# EAGLE design ESP32-S3 Parallel TFT with Touch 3.5'' ili9488 v2.0 (EAGLE 6.1)
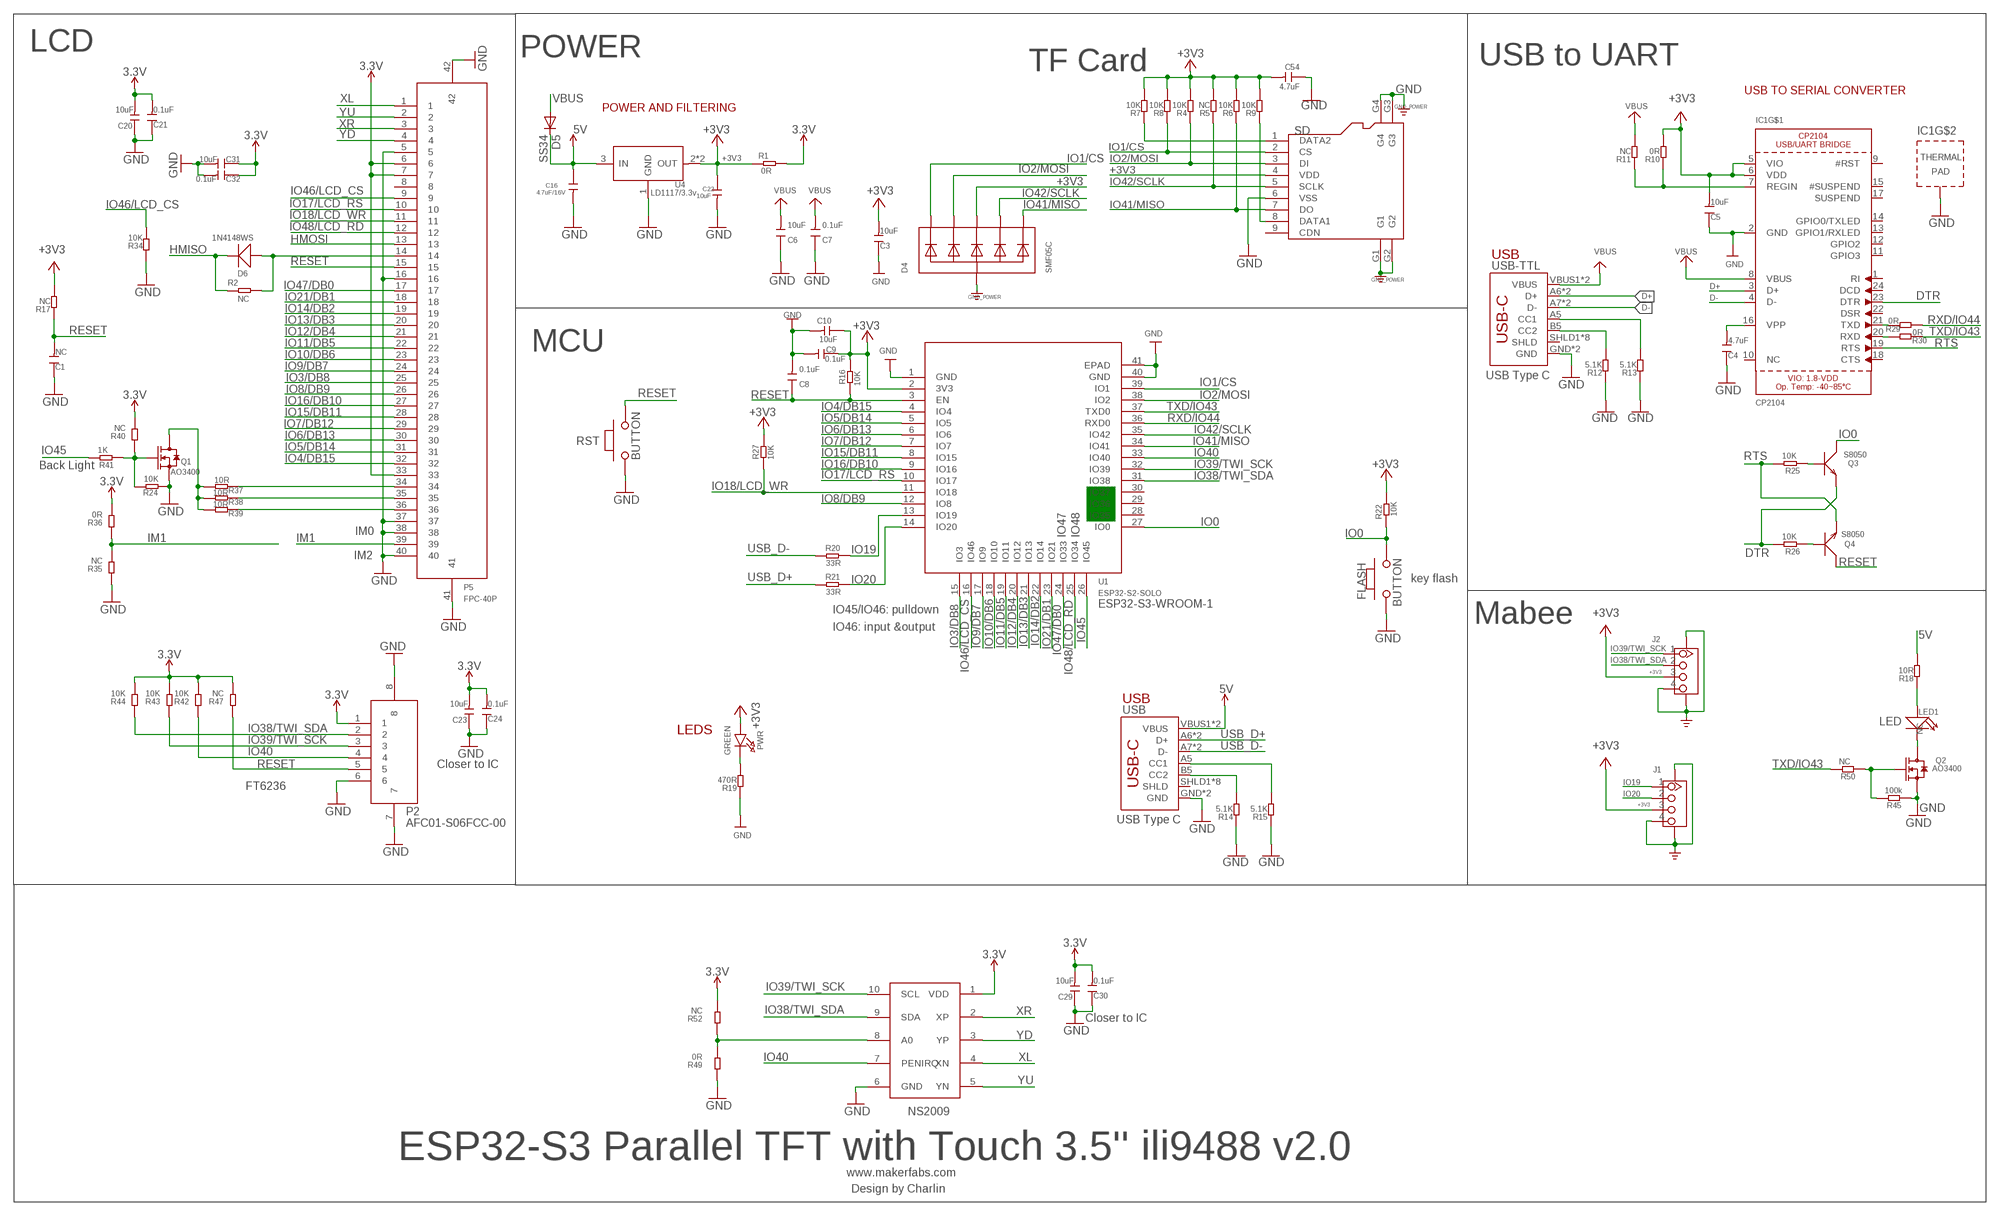
[diagram p0: schematic, sheet 1]

## Parts
C1  NC  DISCRETE_C-0603  [DISCRETE_C0603]
C3  10uF  DISCRETE_C-0603  [DISCRETE_C0603]
C4  4.7uF  DISCRETE_C-0603  [DISCRETE_C0603]
C5  10uF  DISCRETE_C-0603  [DISCRETE_C0603]
C6  10uF  DISCRETE_C-0603  [DISCRETE_C0603]
C7  0.1uF  DISCRETE_C-0603  [DISCRETE_C0603]
C8  0.1uF  DISCRETE_C-0603  [DISCRETE_C0603]
C9  0.1uF  DISCRETE_C-0603  [DISCRETE_C0603]
C10  10uF  DISCRETE_C-0603  [DISCRETE_C0603]
C16  4.7uF/16V  C-0603  [0603]
C20  10uF  DISCRETE_C-0603  [DISCRETE_C0603]
C21  0.1uF  DISCRETE_C-0603  [DISCRETE_C0603]
C22  10uF  C-0603  [0603]
C23  10uF  DISCRETE_C-0603  [DISCRETE_C0603]
C24  0.1uF  DISCRETE_C-0603  [DISCRETE_C0603]
C29  10uF  DISCRETE_C-0603  [DISCRETE_C0603]
C30  0.1uF  DISCRETE_C-0603  [DISCRETE_C0603]
C31  10uF  DISCRETE_C-0603  [DISCRETE_C0603]
C32  0.1uF  DISCRETE_C-0603  [DISCRETE_C0603]
C54  4.7uF  DISCRETE_C-0603  [DISCRETE_C0603]
D4  SMF05C  TVSARRAY_5LANE  [SOT363]
D5  SS34  DIODE-DO-214AC  [DO-214AC]
D6  1N4148WS  D'0805'  [SOD323]
FLASH  BUTTON  PB157  [157SW]
IC1  CP2104  [QFN24_4MM_SMSC]
J1  GROVE-CONNECTOR-SMD'90D'  [HW4-SMD-2.0-90D]
J2  GROVE-CONNECTOR-SMD'90D'  [HW4-SMD-2.0-90D]
LED1  NC  DISCRETE_LED3528  [DISCRETE_LED-3528]
P2  AFC01-S06FCC-00  [SMD8-50P-740L535W]
P5  FPC-40P  [SMD42-50P-2560L490W]
PWR  GREEN  LED0805_NOOUTLINE  [CHIPLED_0805_NOOUTLINE]
Q1  AO3400  MOSFET-N'SOT23'  [SOT23@1]
Q2  AO3400  MOSFET-N'SOT23'  [SOT23@1]
Q3  S8050  TRANSISTOR-NPN-SOT23  [SOT23]
Q4  S8050  TRANSISTOR-NPN-SOT23  [SOT23]
R1  0R  R-0603  [R0603]
R2  NC  R-0603  [R0603]
R4  10K  DISCRETE_R-0603  [DISCRETE_R0603]
R5  NC  DISCRETE_R-0603  [DISCRETE_R0603]
R6  10K  DISCRETE_R-0603  [DISCRETE_R0603]
R7  10K  DISCRETE_R-0603  [DISCRETE_R0603]
R8  10K  DISCRETE_R-0603  [DISCRETE_R0603]
R9  10K  DISCRETE_R-0603  [DISCRETE_R0603]
R10  0R  DISCRETE_R-0603  [DISCRETE_R0603]
R11  NC  DISCRETE_R-0603  [DISCRETE_R0603]
R12  5.1K  DISCRETE_R-0603  [DISCRETE_R0603]
R13  5.1K  DISCRETE_R-0603  [DISCRETE_R0603]
R14  5.1K  DISCRETE_R-0603  [DISCRETE_R0603]
R15  5.1K  DISCRETE_R-0603  [DISCRETE_R0603]
R16  10K  R-0603  [R0603]
R17  NC  DISCRETE_R-0603  [DISCRETE_R0603]
R18  10R  DISCRETE_R-0603  [DISCRETE_R0603]
R19  470R  DISCRETE_R-0603  [DISCRETE_R0603]
R20  33R  R-0603  [R0603]
R21  33R  R-0603  [R0603]
R22  10K  R-0603  [R0603]
R24  10K  DISCRETE_R-0603  [DISCRETE_R0603]
R25  10K  R-0603  [R0603]
R26  10K  R-0603  [R0603]
R27  10K  R-0603  [R0603]
R29  0R  R-0603  [R0603]
R30  0R  R-0603  [R0603]
R34  10K  DISCRETE_R-0603  [DISCRETE_R0603]
R35  NC  DISCRETE_R-0603  [DISCRETE_R0603]
R36  0R  DISCRETE_R-0603  [DISCRETE_R0603]
R37  10R  DISCRETE_R-0603  [DISCRETE_R0603]
R38  10R  DISCRETE_R-0603  [DISCRETE_R0603]
R39  10R  DISCRETE_R-0603  [DISCRETE_R0603]
R40  NC  DISCRETE_R-0603  [DISCRETE_R0603]
R41  1K  DISCRETE_R-0603  [DISCRETE_R0603]
R42  10K  DISCRETE_R-0603  [DISCRETE_R0603]
R43  10K  DISCRETE_R-0603  [DISCRETE_R0603]
R44  10K  DISCRETE_R-0603  [DISCRETE_R0603]
R45  100k  R-0603  [R0603]
R47  NC  DISCRETE_R-0603  [DISCRETE_R0603]
R49  0R  DISCRETE_R-0603  [DISCRETE_R0603]
R50  NC  R-0603  [R0603]
R52  NC  DISCRETE_R-0603  [DISCRETE_R0603]
RST  BUTTON  PB157  [157SW]
SD  HOLDER-MICROSD-9P  [9P-SMD-W/-RING]
U1  ESP32­S2­SOLO  [ESP32-­S2-­SOLO]
U4  LD1117/3.3v  LD1117'SOT89'  [SOT89]
U8  NS2009  [MSOP10]
USB  USB_C5  [USB-C-16P-5]
USB-TTL  USB_C5  [USB-C-16P-5]

## Nets
3.3V: C20.2 C21.2 C23.2 C24.2 C29.2 C30.2 C31.1 C32.1 P2.1 P5.6 P5.7 P5.33 R1.2 R36.2 R40.2 R42.2 R43.2 R44.2 R47.2 R52.2 U8.1(VDD)
5V: C16.1 D5.C R18.2 U4.3(IN) USB.VBUS1(VBUS) USB.VBUS2(VBUS)
+3V3: C3.2 C5.2 C9.1 C10.1 C22.1 C54.2 D4.4(C3) IC1.5(VIO) IC1.6(VDD) J1.3 J2.3 PWR.A R1.1 R4.2 R5.2 R6.2 R7.2 R8.2 R9.2 R10.2 R16.2 R17.2 R22.2 R27.2 SD.4(VDD) U1.2(3V3) U4.2(OUT) U4.4(OUT)
D+: IC1.3(D+) USB-TTL.A6(D+) USB-TTL.B6(D+)
D-: IC1.4(D-) USB-TTL.A7(D-) USB-TTL.B7(D-)
DTR: IC1.23(DTR) Q3.2(E) R26.2
GND: C1.1 C3.1 C4.1 C5.1 C6.1 C7.1 C8.2 C9.2 C10.2 C16.2 C20.1 C21.1 C22.2 C23.1 C24.1 C29.1 C30.1 C31.2 C32.2 C54.1 D4.2(A) FLASH.1 IC1.2(GND) IC1.THERM(TP) J1.4 J1.SS1 J1.SS2 J2.4 J2.SS1 J2.SS2 P2.6 P2.7 P2.8 P5.5 P5.16 P5.37 P5.38 P5.40 P5.41 P5.42 Q1.2(S) Q2.2(S) R12.1 R13.1 R14.1 R15.1 R19.1 R24.1 R34.1 R35.1 R45.1 R49.1 RST.1 SD.6(VSS) SD.G1 SD.G2 SD.G3 SD.G4 U1.1(GND) U1.40(GND) U1.41(EPAD) U4.1(GND) U8.6(GND) USB-TTL.GND USB-TTL.GND2(GND) USB.GND USB.GND2(GND) ; supply symbol labelled GND_POWER
HMISO: D6.- R2.1
HMOSI: P5.13
IM1: P5.39 R35.2 R36.1
IO0: FLASH.2 Q3.3(C) R22.1 U1.27(IO0)
IO1/CS: D4.1(C1) R8.1 SD.2(CS) U1.39(IO1)
IO2/MOSI: D4.3(C2) R4.1 SD.3(DI) U1.38(IO2)
IO3/DB8: P5.25 U1.15(IO3)
IO4/DB15: P5.32 U1.4(IO4)
IO5/DB14: P5.31 U1.5(IO5)
IO6/DB13: P5.30 U1.6(IO6)
IO7/DB12: P5.29 U1.7(IO7)
IO8/DB9: P5.26 U1.12(IO8)
IO9/DB7: P5.24 U1.17(IO9)
IO10/DB6: P5.23 U1.18(IO10)
IO11/DB5: P5.22 U1.19(IO11)
IO12/DB4: P5.21 U1.20(IO12)
IO13/DB3: P5.20 U1.21(IO13)
IO14/DB2: P5.19 U1.22(IO14)
IO15/DB11: P5.28 U1.8(IO15)
IO16/DB10: P5.27 U1.9(IO16)
IO17/LCD_RS: P5.10 U1.10(IO17)
IO18/LCD_WR: P5.11 R27.1 U1.11(IO18)
IO19: J1.1 R20.2 U1.13(IO19)
IO20: J1.2 R21.2 U1.14(IO20)
IO21/DB1: P5.18 U1.23(IO21)
IO38/TWI_SDA: J2.2 P2.2 R44.1 U1.31(IO38) U8.9(SDA)
IO39/TWI_SCK: J2.1 P2.3 R43.1 U1.32(IO39) U8.10(SCL)
IO40: P2.4 R42.1 U1.33(IO40) U8.7(PENIRQ)
IO41/MISO: D4.6(C5) R6.1 SD.7(DO) U1.34(IO41)
IO42/SCLK: D4.5(C4) R5.1 SD.5(SCLK) U1.35(IO42)
IO45: R41.2 U1.26(IO45)
IO46/LCD_CS: P5.9 R34.2 U1.16(IO46)
IO47/DB0: P5.17 U1.24(IO33)
IO48/LCD_RD: P5.12 U1.25(IO34)
N$1: C4.2 IC1.16(VPP)
N$2: Q4.1(B) R26.1
N$3: Q3.1(B) R25.1
N$4: D6.+ P5.14 R2.2
N$5: Q2.1(G) R45.2 R50.1
N$6: R15.2 USB.A5(CC1)
N$7: PWR.C R19.2
N$8: LED1.1(+) R18.1
N$9: LED1.2(-) Q2.3(D)
N$10: R13.2 USB-TTL.A5(CC1)
N$11: R12.2 USB-TTL.B5(CC2)
N$12: IC1.7(REGIN) R10.1 R11.1
N$14: R14.2 USB.B5(CC2)
N$18: IC1.21(TXD) R29.2
N$19: IC1.20(RXD) R30.2
N$20: P5.34 R37.1
N$21: P5.35 R38.1
N$22: P5.36 R39.1
N$23: Q1.1(G) R24.2 R40.1 R41.1
N$24: Q1.3(D) R37.2 R38.2 R39.2
N$25: R49.2 R52.1 U8.8(A0)
N$47: R7.1 SD.1(DATA2)
N$48: R9.1 SD.8(DATA1)
RESET: C1.2 C8.1 P2.5 P5.15 Q4.3(C) R16.1 R17.1 R47.1 RST.2 U1.3(EN)
RTS: IC1.19(RTS) Q4.2(E) R25.2
RXD/IO44: R29.1 U1.36(RXD0)
TXD/IO43: R30.1 R50.2 U1.37(TXD0)
USB_D+: R21.1 USB.A6(D+) USB.B6(D+)
USB_D-: R20.1 USB.A7(D-) USB.B7(D-)
VBUS: C6.2 C7.2 D5.A IC1.8(VBUS) R11.2 USB-TTL.VBUS1(VBUS) USB-TTL.VBUS2(VBUS)
XL: P5.1 U8.4(XN)
XR: P5.3 U8.2(XP)
YD: P5.4 U8.3(YP)
YU: P5.2 U8.5(YN)
Unconnected: IC1.1(RI) IC1.9(#RST) IC1.10(NC) IC1.11(GPIO3) IC1.12(GPIO2) IC1.13(GPIO1/RXLED) IC1.14(GPIO0/TXLED) IC1.15(#SUSPEND) IC1.17(SUSPEND) IC1.18(CTS) IC1.22(DSR) IC1.24(DCD) P5.8 SD.9(CDN) U1.28(IO35) U1.29(IO36) U1.30(IO37) USB-TTL.SHLD1(SHLD) USB-TTL.SHLD2(SHLD) USB-TTL.SHLD3(SHLD) USB-TTL.SHLD4(SHLD) USB-TTL.SHLD5(SHLD) USB-TTL.SHLD6(SHLD) USB-TTL.SHLD7(SHLD) USB-TTL.SHLD8(SHLD) USB.SHLD1(SHLD) USB.SHLD2(SHLD) USB.SHLD3(SHLD) USB.SHLD4(SHLD) USB.SHLD5(SHLD) USB.SHLD6(SHLD) USB.SHLD7(SHLD) USB.SHLD8(SHLD)

## Notes on the sheet
- LCD | POWER
- TF Card | USB to UART
- USB TO SERIAL CONVERTER
- POWER AND FILTERING
- USB
- MCU
- USB Type C
- Back Light
- IM0 | IO47 | IO48
- IM2
- key flash
- ESP32-S3-WROOM-1
- IO45/IO46: pulldown
- Mabee
- IO46: input &output
- USB
- LED
- LEDS
- Closer to IC
- FT6236
- USB Type C
- Closer to IC
- NS2009
- ESP32-S3 Parallel TFT with Touch 3.5'' ili9488 v2.0
- www.makerfabs.com
- Design by Charlin

## Library data of the parts
C1 C3-C10 C20 C21 C23 C24 C29-C32 C54 = A9G:DISCRETE_C*: Ceramic Capacitors
C16 C22 = Discrete:C*: Ceramic Capacitors
D4 = microbuilder:TVSARRAY_5LANE: Voltage Transient Suppressor Array SOT363 SMF05C - 100W 5V: Digikey - SMF05CT1GOSCT-ND
D5 = diode:DIODE-: DIODE
D6 = Discrete:D*
FLASH RST = MySMD:PB157
IC1 = microbuilder:CP2104: CP2104 - USB to UART Bridge VDD Output: 3.45V
J1 J2 = Connector-new:GROVE-CONNECTOR-SMD: 4P-SMD-2.0:320110030;4P-SMD-2.0-90D:320110032
LED1 = Relay:DISCRETE_LED*
P2 = self:AFC01-S06FCC-00
P5 = self:FPC-40P
PWR = microbuilder:LED: LED 0603 - 0603 Surface Mount Package 2mA: Green LED - Low Power (3.9mcd, 2ma, 1.7Vf) - Digikey: 475-2709-2-ND Orange LED - Low Power (9.8mcd, 2ma, 1.8Vf) - Digikey: 475-1194-2-ND Red LED - Low Power (5mcd, 2ma, 1.8Vf) - Digikey: 475-1195-2-ND Yellow LED - Low Power (7mcd, 2ma, 1.8Vf) - Digikey: 475-1196-2-ND 5mA: Blue LED - Low Power (17mcd, 5ma, 2.9Vf) - Digikey: LNJ937W8CRACT-ND 0805 - 0805 Surface Mount Package 2mA: Red LED (8.8mcd, 2mA, 1.8Vf, Clear) - Low Power [Digikey: 475-2510-1-ND] Green LED (5mcd, 2mA, 1.8Vf, Clear) - Low Power [Digikey: 475-2730-1-ND] Yellow LED (11.3mcd, 2mA, 1.8Vf, Clear) - Low Power [Digikey: 475-2555-1-ND] 20mA: Red LED (104mcd, 20mA, Diffused) - LS R976 [Digikey: 475-1278-6-ND] Red LED (12mcd, 20mA, 2.0Vf, Clear) - APT2012EC [Digikey: 754-1128-1-ND] Green LED (15mcd, 20mA, 2.2Vf, Clear) - APT2012GC [Digikey: 754-1131-1-ND] Orange LED (160mcd, 20mA, 2.1Vf, Clear) - APT2012SECK [Digikey: 754-1130-1-ND] 1206 - 1206 Surface Mount Package Green LED (26mcd, 20mA, Diffused) - LG N971 [Digikey: 475-1407-6-ND] Red LED (15mcd, 20mA, Diffused) - LH N974 [Digikey: 475-1416-6-ND] Cree - Cree High-Power Surface Mount LEDs XPEBWT-L1-0000-00D50 - White 111lm 350mA 2.9Vf 6200K 110° XTEAWT-00-0000-00000LEE3 - White 114lm 350mA 2.85Vf 5000K 115° Everlight - Everlight 45-21 Series Surface Mount LEDs 45-21/QK2C-B2832AC2CB2/2T - Warm White 2000mcd 20mA 3.25Vf 3050K 120° 45-21/LK2C-B38452C4CB2/2T - Nuetral White 2000mcd 20mA 3.25Vf 4150K 120° 45-21/LK2C-B50634C6CB2/2T - Cold White 2200mcd 20mA 3.25Vf 5650K 120° PLCC2 Reverse Mount LS T77K-J1L2-1-0-2-R18-Z - Red 11.25mcd 2mA 1.8Vf 630nm 120° LO T77K-L1M2-24-Z - Orange 19.6mcd 2mA 1.8Vf 606nm 120° LY T77K-K2M1-26-Z - Yellow 15.7mcd 2mA 1.8Vf 587nm 120°
Q1 Q2 = Discrete:MOSFET-N: IRLL014: http://www.vishay.com/docs/91319/sihll014.pdf
Q3 Q4 = Discrete:TRANSISTOR-NPN*: NPN audion
R1 R2 R16 R20-R22 R25-R27 R29 R30 R45 R50 = Discrete:R*
R4-R15 R17-R19 R24 R34-R44 R47 R49 R52 = A9G:DISCRETE_R*
SD = Connector:HOLDER-MICROSD-9P
U1 = self:ESP32­S2­SOLO
U4 = IC:LD1117: Low Drop Fixed And Adjustable Positive Voltage Regulators http://www.datasheetcatalog.org/datasheet/SGSThomsonMicroelectronics/mXuqtqv.pdf
U8 = NS2009:NS2009
USB USB-TTL = USBC:USB_C: USB Type C 16Pin Connector Super Speed pins not available on the 16-pin purely SMD connector so this part is best for USB 2.0 implementations. D1 and D2 are tied together enabling D+/- no matter which way the cable is plugged into the connector. The two channel configuration pins (CC1/2) are exposed. These are normally connected to ground via 5.1k resistors but can be reconfigured for high current/high power applications.

## Net classes
1 vbat: width 0.254 mm, drill 0.305 mm, clearance 0.152 mm

## Board
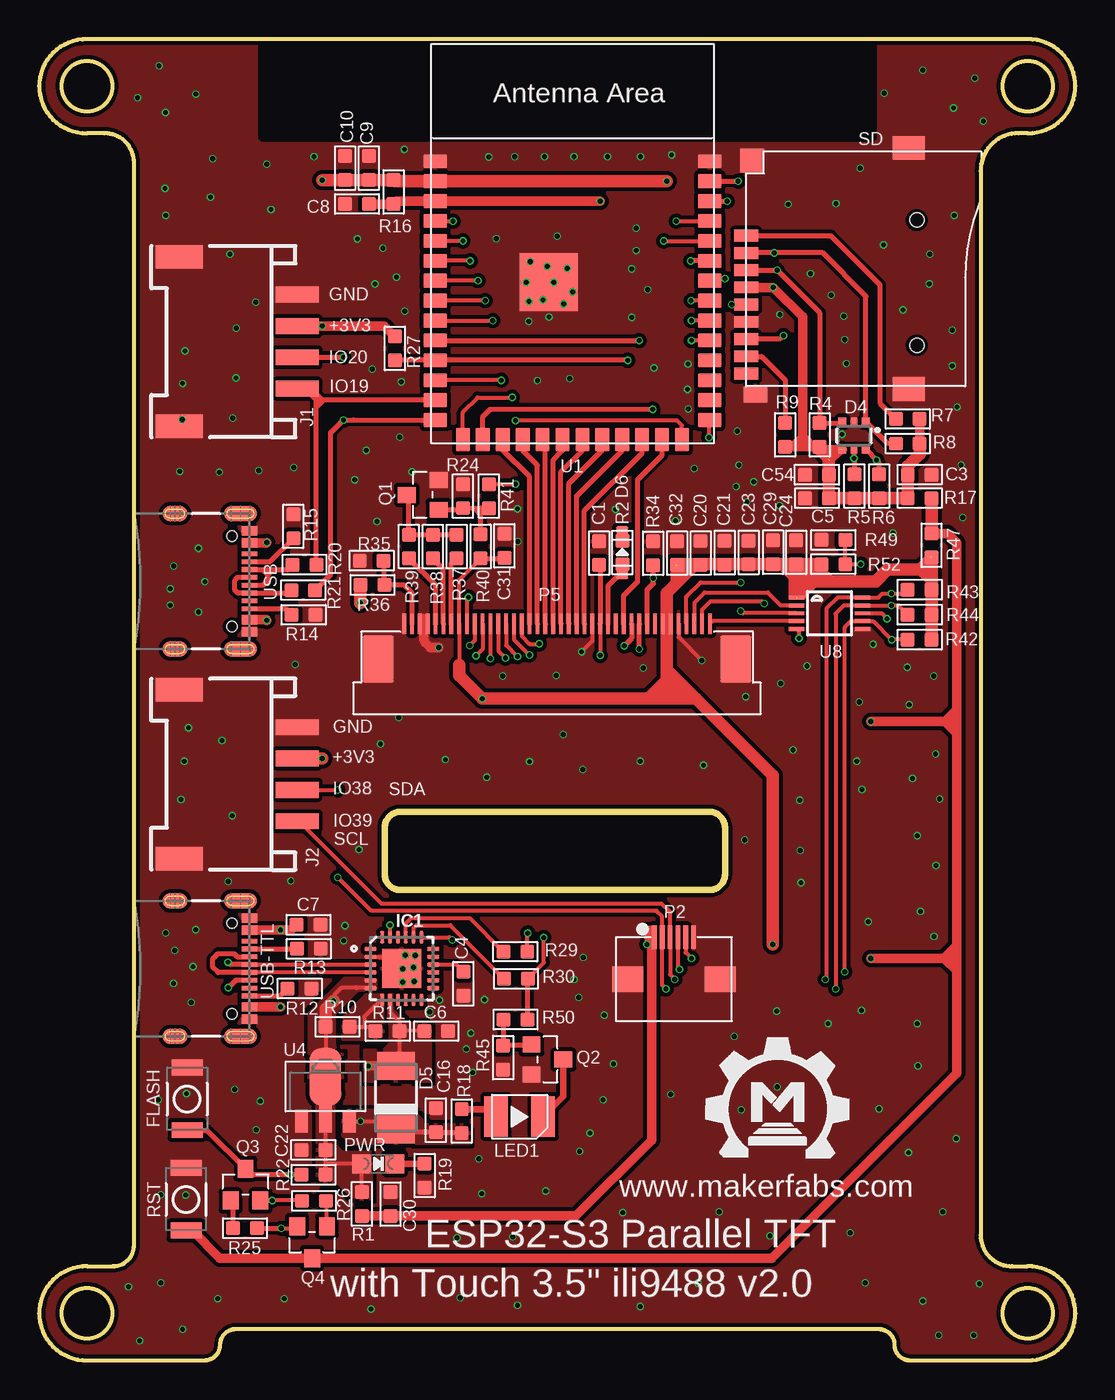
[diagram p1: board, top side]
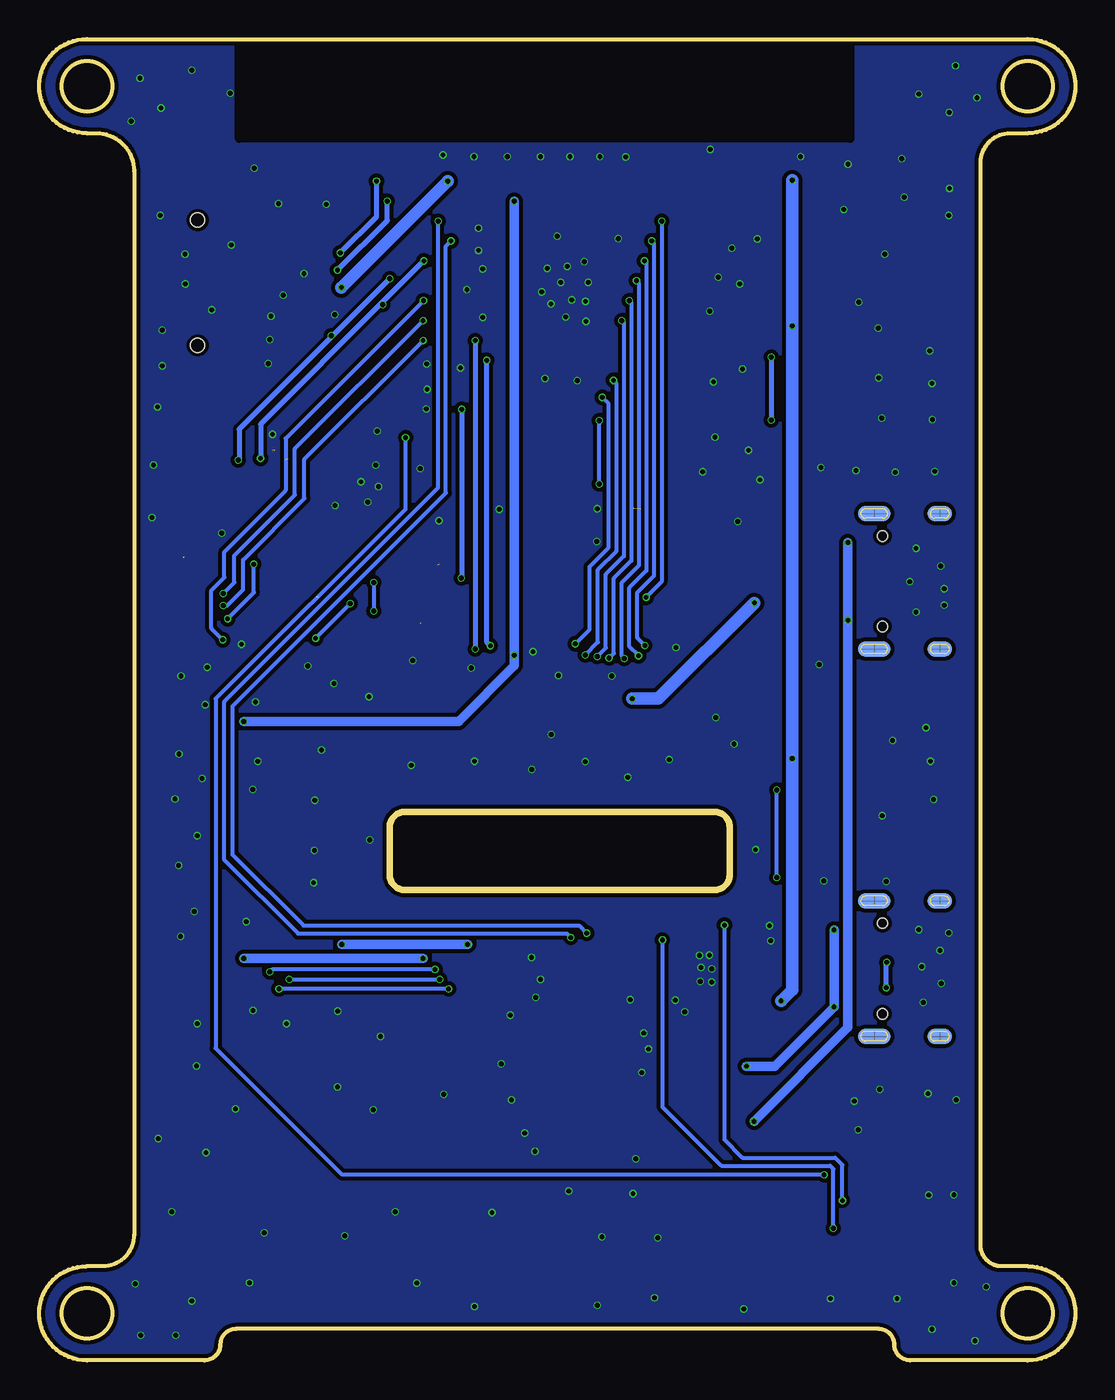
[diagram p2: board, bottom side, seen from below]

Size 66.1 x 84.3 mm. Coordinates in mm from the lower left corner, seen from the top.
Outline: 55.55,0 63.05,0 arc182 63.05,6 62.05,6 arc-90 60.05,8 60.05,75.9 arc-90 62.45,78.3 63.05,78.3 arc182 63.05,84.3 3.05,84.3 arc182 3.05,78.3 4.17,78.3 arc-90 6.05,76.42 6.05,7.34 arc-90 4.7,6 3.05,6 arc182 3.05,0 10.55,0 arc90 11.55,1 arc-90 12.55,2 53.55,2 arc-90 54.55,1 arc90 55.55,0
Outline: 23.05,35 42.75,35 arc-90 43.75,34 43.75,31 arc-90 42.75,30 23.05,30 arc-90 22.05,31 22.05,34 arc-90 23.05,35
Outline: circle at 3.05,81.3 radius 1.6
Outline: circle at 3.05,3 radius 1.6
Outline: circle at 63.05,3 radius 1.6
Outline: circle at 63.05,81.3 radius 1.6
Copper layers (1*16): Top 0.035mm / dielectric 1.5mm / Bottom 0.035mm
Design rules: minimum track width 6mil, minimum drill 10mil, track to track 6mil, track to pad 6mil, pad to pad 6mil, via to via 6mil, smd to smd 0mil, copper to edge 10mil, drill to drill 10mil, minimum pad ring 3mil, minimum via ring 3mil, stop-mask expansion 2mil, vias tented up to drill 100mil, thermal gap 0mil
tRestrict: area 14.2,78 to 53.2,85
bRestrict: area 14.4,77.9 to 53.4,84.9

### Footprints (pad centres in the part's own frame; a part is rotated, then mirrored left to right if it is on the bottom)
DISCRETE_C0603 = smd 0.889 x 0.889: 1 -0.762,0; 2 0.762,0
0603 = smd 0.889 x 0.889: 1 -0.762,0; 2 0.762,0
SOT363 = smd 0.5 x 0.5: 1 -0.75,-0.9; 3 0.75,-0.9; 4 0.75,0.9; 6 -0.75,0.9 | smd 0.4 x 0.5: 2 0,-0.9; 5 0,0.9
DO-214AC = smd 1.8 x 2.4: A 2.025,0; C -2.025,0
SOD323 = smd 1 x 0.8: + -1.2,0; - 1.2,0
157SW = smd 1.016 x 1.981: 1 0,0; 2 4,0
QFN24_4MM_SMSC = smd 0.8 x 0.28: 1 -2,1.25; 2 -2,0.75; 3 -2,0.25; 4 -2,-0.25; 5 -2,-0.75; 6 -2,-1.25; 13 2,-1.25; 14 2,-0.75; 15 2,-0.25; 16 2,0.25; 17 2,0.75; 18 2,1.25 | smd 0.28 x 0.8: 7 -1.25,-2; 8 -0.75,-2; 9 -0.25,-2; 10 0.25,-2; 11 0.75,-2; 12 1.25,-2; 19 1.25,2; 20 0.75,2; 21 0.25,2; 22 -0.25,2; 23 -0.75,2; 24 -1.25,2 | smd 2.5 x 2.5: THERM 0,0
HW4-SMD-2.0-90D = smd 1.01 x 2.74: 1 -3,-0.1; 2 -1,-0.1; 3 1,-0.1; 4 3,-0.1 | smd 1.5 x 3: SS1 -5.4,7.4; SS2 5.4,7.4
DISCRETE_LED-3528 = smd 1.5 x 2.6: 1 -1.5,0; 2 1.5,0
SMD8-50P-740L535W = smd 0.3 x 1.5: 1 -1.25,0; 2 -0.75,0; 3 -0.25,0; 4 0.25,0; 5 0.75,0; 6 1.25,0 | smd 2 x 1.6: 7 2.95,-2.68; 8 -2.95,-2.68
SMD42-50P-2560L490W = smd 0.3 x 1.3: 1 9.75,0; 2 9.25,0; 3 8.75,0; 4 8.25,0; 5 7.75,0; 6 7.25,0; 7 6.75,0; 8 6.25,0; 9 5.75,0; 10 5.25,0; 11 4.75,0; 12 4.25,0; 13 3.75,0; 14 3.25,0; 15 2.75,0; 16 2.25,0; 17 1.75,0; 18 1.25,0; 19 0.75,0; 20 0.25,0; 21 -0.25,0; 22 -0.75,0; 23 -1.25,0; 24 -1.75,0; 25 -2.25,0; 26 -2.75,0; 27 -3.25,0; 28 -3.75,0; 29 -4.25,0; 30 -4.75,0; 31 -5.25,0; 32 -5.75,0; 33 -6.25,0; 34 -6.75,0; 35 -7.25,0; 36 -7.75,0; 37 -8.25,0; 38 -8.75,0; 39 -9.25,0; 40 -9.75,0 | smd 2 x 3: 41 -11.4,-2.25; 42 11.4,-2.25
CHIPLED_0805_NOOUTLINE = smd 1.2 x 1.2: A 0,-1.05; C 0,1.05
SOT23@1 = smd 1.016 x 1.143: 1 -0.95,-1.016; 2 0.95,-1.016; 3 0,1.016
SOT23 = smd 1.016 x 1.143: 1 -0.95,-1.016; 2 0.95,-1.016; 3 0,1.016
R0603 = smd 0.889 x 0.889: 1 -0.762,0; 2 0.762,0
DISCRETE_R0603 = smd 0.889 x 0.889: 1 -0.762,0; 2 0.762,0
9P-SMD-W/-RING = smd 1.524 x 0.762: 1 0,4.4; 2 0,3.3; 3 0,2.2; 4 0,1.1; 5 0,0; 6 0,-1.1; 7 0,-2.2; 8 0,-3.3; 9 0,-4.4 | smd 1.524 x 1.016: G1 0.6,-5.746 | smd 2.032 x 1.524: G2 10.373,-5.4; G3 10.373,10 | smd 1.524 x 1.524: G4 0.392,9.181 | hole 0.889: 10.9,-2.6; 10.9,5.4
ESP32-­S2-­SOLO = smd 1.5 x 0.9: 1 -8.75,5.26; 2 -8.75,3.99; 3 -8.75,2.72; 4 -8.75,1.45; 5 -8.75,0.18; 6 -8.75,-1.09; 7 -8.75,-2.36; 8 -8.75,-3.63; 9 -8.75,-4.9; 10 -8.75,-6.17; 11 -8.75,-7.44; 12 -8.75,-8.71; 13 -8.75,-9.98; 14 -8.75,-11.25; 27 8.75,-11.25; 28 8.75,-9.98; 29 8.75,-8.71; 30 8.75,-7.44; 31 8.75,-6.17; 32 8.75,-4.9; 33 8.75,-3.63; 34 8.75,-2.36; 35 8.75,-1.09; 36 8.75,0.18; 37 8.75,1.45; 38 8.75,2.72; 39 8.75,3.99; 40 8.75,5.26 | smd 0.9 x 1.5: 15 -6.985,-12.5; 16 -5.715,-12.5; 17 -4.445,-12.5; 18 -3.175,-12.5; 19 -1.905,-12.5; 20 -0.635,-12.5; 21 0.635,-12.5; 22 1.905,-12.5; 23 3.175,-12.5; 24 4.445,-12.5; 25 5.715,-12.5; 26 6.985,-12.5 | smd 3.7 x 3.7: 41 -1.5,-2.46
SOT89 = smd 0.8 x 1.4: 1 -1.524,-1.905; 3 1.524,-1.905 | smd 0.8 x 1.9: 2 0,-1.651 | smd 2.032 x 3.65: 4 0,0.94
MSOP10 = smd 0.25 x 1: 1 -1,-2.113; 2 -0.5,-2.113; 3 0,-2.113; 4 0.5,-2.113; 5 1,-2.113; 6 1,2.113; 7 0.5,2.113; 8 0,2.113; 9 -0.5,2.113; 10 -1,2.113
USB-C-16P-5 = smd 0.3 x 1: A5 -1.25,-0.34; A6 -0.25,-0.34; A7 0.25,-0.34; A8 1.25,-0.34; B5 1.75,-0.34; B6 0.75,-0.34; B7 -0.75,-0.34; B8 -1.75,-0.34 | smd 0.6 x 1: GND -3.225,-0.34; GND2 3.225,-0.34; VBUS1 -2.45,-0.34; VBUS2 2.45,-0.34 | smd 1 x 2.1: SHLD1 -4.32,-0.915; SHLD2 4.32,-0.915 | smd 1 x 2.1 bottom: SHLD3 -4.32,-0.915; SHLD4 4.32,-0.915 | smd 1 x 1.6: SHLD5 -4.32,-5.095; SHLD8 4.32,-5.095 | smd 1 x 1.6 bottom: SHLD6 -4.32,-5.095; SHLD7 4.32,-5.095 | hole 0.65: -2.89,-1.445; 2.89,-1.445

### Placement (x,y rotation side)
C1  35.72,51.51 270 top
C3  56.16,56.52 180 top
C4  27.05,24.03 90 top
C5  49.61,55.02 0 top
C6  25.33,21.01 180 top
C7  17.17,27.79 180 top
C8  20.27,73.79 180 top
C9  21.03,76.07 90 top
C10  19.51,76.07 90 top
C16  25.3,15.32 90 top
C20  42.2,51.51 270 top
C21  43.72,51.53 270 top
C22  17.49,13.43 180 top
C23  45.25,51.54 270 top
C24  48.28,51.56 270 top
C29  46.81,51.57 270 top
C30  22.41,9.97 270 top
C31  29.68,51.97 90 top
C32  40.69,51.51 90 top
C54  49.61,56.51 0 top
D4  51.98,59 180 top
D5  22.76,16.76 90 top
D6  37.19,51.53 90 top
FLASH  9.44,18.69 270 top
IC1  23.13,25 0 top
J1  16.35,65 90 top
J2  16.35,37.4 90 top
LED1  30.64,15.54 0 top
P2  40.49,27 0 top
P5  33.03,47 0 top
PWR  21.63,12.54 270 top
Q1  24.46,55.22 90 top
Q2  32.42,19.2 270 top
Q3  13.16,11.21 0 top
Q4  17.41,7.54 180 top
R1  20.58,9.98 270 top
R2  37.2,51.54 270 top
R4  49.79,59.05 270 top
R5  52,55.78 270 top
R6  53.57,55.78 270 top
R7  55.4,60.07 0 top
R8  55.4,58.5 0 top
R9  47.58,59.05 270 top
R10  19.03,21.29 180 top
R11  22.23,21.01 0 top
R12  16.61,23.72 180 top
R13  17.2,26.26 180 top
R14  16.87,47.57 180 top
R15  16.21,53.21 270 top
R16  22.61,74.55 90 top
R17  56.16,55.02 180 top
R18  26.95,15.27 270 top
R19  24.59,11.79 90 top
R20  16.92,50.77 0 top
R21  16.84,49.15 0 top
R22  17.5,11.84 0 top
R24  27.03,55.14 270 top
R25  13.13,8.43 0 top
R26  17.53,10.18 180 top
R27  22.69,64.57 90 top
R29  30.37,26.07 180 top
R30  30.41,24.35 180 top
R34  39.16,51.49 270 top
R35  21.21,51.02 0 top
R36  21.25,49.48 180 top
R37  26.63,51.92 90 top
R38  25.12,51.92 90 top
R39  23.58,51.92 90 top
R40  28.16,51.93 270 top
R41  28.68,55.14 90 top
R42  56.16,45.98 0 top
R43  56.16,49.17 0 top
R44  56.16,47.58 0 top
R45  29.59,19.32 90 top
R47  56.92,52 270 top
R49  50.66,52.34 0 top
R50  30.38,21.75 0 top
R52  50.65,50.81 180 top
RST  9.37,12.29 270 top
SD  45.09,67.36 0 top
U1  34.01,71.25 0 top
U4  18.25,17.16 0 top
U8  50.41,47.67 270 top
U$1  [MAKERFABS_0.3]  42.99,12.96 0 top
USB  13.75,49.71 270 top
USB-TTL  13.75,25 270 top

### Tracks (layer width: path | path; a pad name or v marks a point on that pad's centre or on a via)
3.3V  (via drill 0.3)  (3 unrouted)
  Top 0.254: 20.48,49.46 R36.2 | P5.7 P5.6 40.03,47.24 | 26.78,44.38 P5.33 26.78,49.8 R40.2 | P2.1 v38.77,26.54 38.74,26.58 38.74,27.61 39.14,27.61 38.99,27.46 38.97,27.46 38.97,26.78 39.07,26.68 | U8.1 47.98,48.67 47.93,48.72 47.93,50.27 47.4,50.81 | 48.16,48.74 48.16,49.89 48.3,49.75 48.39,49.66 48.39,48.69 48.57,48.69 48.62,48.74 48.62,49.38 48.67,49.43 49.51,49.43 48.75,48.67 48.42,48.67 49.25,49.51 49.15,49.61 48.49,48.95 48.49,48.92 49.15,49.58 50.47,49.58 50.55,49.66 50.55,49.96 50.04,50.47 50.04,50.22
  Top 0.305: R40.2 29.64,51.17 C31.1
  Top 0.61: R1.2 C30.2 34.23,9.21 39.07,14.05 39.07,26.68 | 50.04,50.22 48.59,50.22 | 41.38,50.77 40.57,50.77 40.57,49.58 40.21,49.23 | 56.92,49.68 56.9,49.68 56.09,50.49 56.85,51.26 | C23.2 C21.2 43.7,50.75 C20.2 42.2,50.8 42.19,50.81 | C29.2 47.24,50.8 48.3,49.75 | 48.7,49.71 48.44,49.71 48.39,49.66
  Top 0.813: 20.48,49.46 v20.48,48.34 | 26.78,44.38 26.78,43.69 v28.26,42.22 38.84,42.22 | 40.03,44.07 40.03,47.24 40.03,48.97 41.87,50.81 | 40.03,44.07 40.03,43.41 38.84,42.22 | 41.87,50.81 42.19,50.81 47.4,50.81 R52.2 | C32.1 40.75,50.81 41.87,50.81 | R42.2 R44.2 R43.2 56.92,50.49 | 56.92,50.49 R47.2 | C24.2 48.29,50.12 48.7,49.71 53.37,49.71 54.11,50.44 56.87,50.44 56.92,50.49 | v46.79,26.54 46.79,37.31 41.89,42.22 | 41.89,42.22 40.08,42.22 | 40.08,42.22 38.84,42.22 | 41.89,42.22 40.08,44.02 | 40.03,44.07 40.08,44.02 | 40.08,44.02 40.08,42.22 | 40.08,42.22 40.97,43.1
  Bottom 0.61: v38.77,26.54 v46.79,26.54
  Bottom 0.813: v28.26,42.22 26.6,42.22 v20.48,48.34
5V  (via drill 0.3)
  Top 0.254: U4.3 v20.5,15.24 20.51,15.25 22.25,15.25
  Top 0.305: 22.25,15.25 D5.C 22.94,14.56 C16.1 26.9,14.56 R18.2
  Top 0.61: USB.VBUS1 14.49,52.16 v14.51,52.17 | USB.VBUS2 14.47,47.26 v14.51,47.22
  Bottom 0.61: v14.51,52.17 v14.51,47.22 14.51,21.23 v20.5,15.24
  pour Top: 19.38,15.95 23.75,15.95 24.69,15.01 27.38,15.01 27.38,14 27.38,13.84 19.89,13.84 19.38,14.35
+3V3  (via drill 0.3)  (2 unrouted)
  Top 0.254: 18.25,12.39 C22.1 U4.2 U4.4 R10.2 18.27,22.73 19.28,23.75 20.25,23.75 | 18.25,12.39 18.25,11.85 R22.2 | 18.25,12.39 18.4,12.54 PWR.A R1.1 | 16.47,38.41 J2.3 | 20.25,23.75 IC1.6 IC1.5 | 20.2,23.8 20.25,23.75
  Top 0.61: SD.4 v46.82,68.46 48.7,66.58 48.7,58.95 | 48.7,58.95 48.7,58.88 | 48.7,58.88 48.7,58.29 | 48.7,58.29 49.36,58.29 | 49.36,58.29 R4.2 49.98,58.1 50.37,58.1 | R9.2 48.11,58.29 | 48.11,58.29 48.7,58.29 | 50.37,58.1 D4.4 | 50.37,58.1 | R7.2 R8.2 | 48.7,58.88 48.11,58.29 | 48.7,58.95 49.36,58.29 | 50.4,57.43 51.06,58.09 | 50.3,57.51 49.61,58.19 | R27.2 22.01,66 v18.06,66 J1.3
  Top 0.813: 16.47,38.41 v18.06,38.41 | v18.77,22.94 18.27,22.43 R10.2 | v40.03,75.23 v40.03,75.24 U1.2 22.68,75.24 R16.2 C9.1 C10.1 v18.06,75.31 | R4.2 50.37,57.71 C54.2 C5.2 R5.2 R6.2 R17.2 C3.2 55.4,57.05 56.16,57.81 R8.2
  Bottom 0.813: v18.77,22.94 18.06,23.65 v18.06,38.41 v18.06,66 v18.06,75.31 | v40.03,75.23 v40.04,75.23 v46.82,68.46
  pour Top: 21.47,24.33 19.46,24.33 17.22,22.1 17.22,16.64 17.73,16.13 17.73,11.38 19.03,11.38 20.07,10.34 21.19,10.34 21.19,13.23 19.33,13.23 18.8,13.77 18.8,16.18 19.33,16.71 19.33,19.53 18.82,20.04 18.82,22.15 20.35,23.67 21.44,23.67 21.47,23.67
D+  (via drill 0.3)
  Top 0.254: USB-TTL.A6 IC1.3
  Top 0.305: USB-TTL.B6 12.54,24.25 v12.07,23.77 | USB-TTL.A6 12.2,25.25 v12.04,25.4
  Bottom 0.305: v12.07,23.77 12.07,25.38 v12.04,25.4
D-
  Top 0.254: IC1.4 USB-TTL.A7
  Top 0.305: USB-TTL.A7 11.41,24.74 11.08,25.07 11.08,25.63 11.41,25.96 12.42,25.96 12.63,25.75 USB-TTL.B7
DTR  (via drill 0.3)
  Top 0.254: IC1.23 v22.38,27.76 | R26.2 16.75,10.2 v14.86,10.2
  Top 0.305: Q3.2 v14.86,10.2
  Bottom 0.254: v14.86,10.2 14.86,12.47 15.32,12.93 21.24,12.93 22.38,14.07 v22.38,27.76
GND  (via drill 0.3)
  Top 0.254: IC1.2 22.38,25.75 IC1.THERM | P5.16 35.28,45.9 v34.6,45.21 | P5.5 40.78,46.14 v42.27,44.65 | P5.38 24.53,47 24.54,46.99
  Top 0.61: 24.54,46.99 24.54,47.32 24.51,47.35 24.51,45.95 24.64,45.82 24.64,45.8 24.95,45.49 v25.48,45.49
  other vias: 58.32,79.91 59.67,81.81 56.37,82.32 53.9,80.85 60.23,79.07 8.05,79.63 7.65,82.6 9.99,80.8 33.43,39.93 25.91,38.33 31.27,38.2 38.33,38.23 29.57,43.66 32.97,43.69 21.54,53.52 23.78,56.69 30.51,54.33 30.53,52.25 29.16,71.58 33.05,71.73 31.07,68.78 32.41,69.8 32.51,66.57 33.84,62.64 31.22,66.29 31.78,62.51 34.04,68.17 38.08,72.24 38.08,70.82 37.8,66.55 38.81,68.33 37.8,69.65 28.68,76.78 30.33,76.81 32.24,76.81 34.12,76.81 36.25,76.81 38.36,76.81 40.34,76.91 50.83,73.81 52.38,76.07 56.8,70.59 56.77,68.68 58.37,73.05 58.25,65.74 53.85,71.17 47.78,73.76 50.52,67.97 51.39,65.13 51.49,63.6 47.25,66.73 44.63,57.12 47.22,54.53 45.57,56.06 44.53,59.28 58.55,60.83 58.8,57.12 58.91,53.77 57.05,43.66 57.18,38.68 55.5,41.83 56.01,33.48 57.08,27.05 57.43,35.81 56.21,28.65 59.62,1.6 57.38,1.6 59.97,4.88 55.45,13.26 51.74,8.13 42.01,4.93 46.61,7.95 47.07,17.45 44.33,20.68 50.32,21.49 52.68,4.95 30.51,3.51 21.16,3.28 11.38,3.94 7.75,4.95 6.4,1.24 9.15,1.98 9.35,10.54 9.4,17.02 14.1,16.54 23.35,25.86 23.98,25.83 23.88,25.07 23.93,24.18 23.19,24.13 23.19,24.97 24.92,22.23 27.54,20.88 35.13,14.5 35.97,16.61 36.05,22.02 8.56,24.05 8.64,26.16 8.08,27.28 9.05,35.79 9.25,38.23 9.53,40.36 8.36,48.18 8.36,49.23 8.59,50.67 9.12,60.02 9.15,62.33 9.3,64.41 8.08,73.05 8.03,74.78 6.28,80.57 11.08,76.68 11.66,39.55 12.32,34.75 16.34,44.4 21.77,39.32 19.51,27.74 20.4,32.59 28.4,23.01 27.66,18.36 28.22,10.64 26.65,7.82 30.2,7.87 37.21,9.42 40.29,16.97 34.12,24.31 36.63,18.92 44.78,15.98 56.06,18.8 15.62,3.94 26.85,3.99 38.33,3.43 7.6,16.61 7.75,10.57 12.47,17.3 13.85,14.71 9.71,22.83 9.81,25.12 9.99,27.48 16.06,30.58 10.16,47.75 10.57,49.68 10.16,51.82 14,56.77 12.35,60.12 12.55,62.69 12.58,65.86 12.17,70.59 10.92,74.22 36.76,54.31 44.45,55.75 54.46,52.78 45.14,54.76 45.06,42.34 47.3,43.18 34.67,37.69 28.55,37.21 22.94,41.02 45.01,33.2 42.37,37.97 52.89,27.99 32.13,67.67 33.45,67.41 32.82,68.78 33.68,69.67 31.32,70.1 31.24,67.56 23.29,77.27 14.51,76.33 13.82,67.51 14.79,73.43 52.48,36.42 48.09,38.94 52.15,38.23 55.71,37.13 57.2,31.57 52.45,22.33 56.01,21.49 53.57,16.05 56.37,3.78 32.31,10.79 27.23,19.86 28.04,12.85 34.47,13.34 34.42,23.16 19.43,26.77 12.07,30.56 5.69,4.7 40.59,53.57 41.79,56.9 41.35,61.95 41.4,60.71 41.38,63.58 39.22,63.32 49.2,69.34 51.31,66.62 55.1,67.03 58.25,63.45 51.21,59.08 52.3,42.01 55.37,44.22 53.19,45.69 48.97,44.3 48.59,30.48 48.52,35.74 48.54,32.54 47.04,22.28 43.39,9.47 57.64,9.47 58.5,14.15 25.53,22.99 22.79,69.11 21.92,70.97 20.3,71.55 21.42,68.68 23.09,62.43 21.24,63.25 23.32,66.95 22.99,58.9 20.86,58.06 20.12,56.18 16.23,56.97 8.97,56.72 11.48,56.67 17.53,76.81 38.53,44.17 34.7,25.7
  pour Top (isolate 0.254, rank 6): -0.95,85 -0.95,0 66.05,0 66.05,85
  pour Bottom (isolate 0.254, rank 6): 0.05,0 66.05,0 66.05,85 0.05,85
HMISO
  Top 0.305: R2.1 37.2,52.72 D6.-
IM1
  Top 0.305: P5.39 23.78,48.97 23.27,49.48 R36.1 22.02,50.98 R35.2
IO0  (via drill 0.3)
  Top 0.254: R22.1 v16.02,11.84 | v42.73,58.88 42.73,59.96 U1.27 | 15.71,11.84 v16.02,11.84 | v16.02,11.84 v16.03,11.84
  Top 0.305: R22.1 15.71,11.84 13.55,11.84 Q3.3 10.7,14.69 FLASH.2
  Bottom 0.254: v16.03,11.84 46.76,11.84 54.84,19.91 54.84,42.22 42.73,54.33 v42.73,58.88
IO1/CS  (via drill 0.3)
  Top 0.305: R8.1 54.13,58.5 D4.1 52.73,67.9 49.97,70.66 v46.89,70.66 SD.2 | U1.39 44.02,75.24 v44.58,75.23
  Bottom 0.305: v46.89,70.66 44.58,72.97 v44.58,75.23
IO2/MOSI  (via drill 0.3)
  Top 0.305: SD.3 v47.07,69.56 49.79,66.84 R4.1 51.14,59.82 D4.3 | U1.38 v43.89,73.97
  Bottom 0.305: v47.07,69.56 43.89,72.73 v43.89,73.97
IO3/DB8  (via drill 0.3)
  Top 0.254: P5.25 30.78,46.21 31.27,45.72 v31.91,45.72 | U1.15 27.03,60.5 27.97,61.44 v30.18,61.44
  Bottom 0.254: v31.91,45.72 30.99,46.63 30.99,50.65 29.77,51.87 29.77,61.04 v30.18,61.44
IO4/DB15  (via drill 0.3)
  Top 0.254: U1.4 v26.39,72.7 v26.39,72.69 | v27.38,48.69 27.28,48.59 P5.32
  Bottom 0.254: v26.39,72.69 26.39,49.68 v27.38,48.69
IO5/DB14  (via drill 0.3)
  Top 0.254: P5.31 27.78,45.94 v27.46,45.62 | U1.5 v27.03,71.43 v27.03,71.42
  Bottom 0.254: v27.46,45.62 27.94,46.1 27.94,49 26.88,50.06 26.88,71.27 v27.03,71.42
IO6/DB13  (via drill 0.3)
  Top 0.254: P5.30 28.28,45.37 v27.87,44.96 | U1.6 v27.48,70.16 v27.49,70.16
  Bottom 0.254: v27.87,44.96 28.45,45.54 28.45,49.3 27.36,50.39 27.36,70.03 v27.49,70.16
IO7/DB12  (via drill 0.3)
  Top 0.254: P5.29 v28.78,44.78 | v27.99,68.89 U1.7
  Bottom 0.254: v28.78,44.78 28.93,44.93 28.93,49.63 28.69,49.87 27.84,50.72 27.84,68.73 v27.99,68.89
IO8/DB9  (via drill 0.3)
  Top 0.254: P5.26 30.28,46 v31.27,45.01 | v29.47,62.53 v29.47,62.54 U1.12
  Bottom 0.254: v31.27,45.01 30.46,45.82 30.46,50.44 29.29,51.61 29.29,62.36 v29.47,62.53
IO9/DB7
  Top 0.305: P5.24 31.28,56.38 29.57,58.09 U1.17
IO10/DB6
  Top 0.305: P5.23 31.78,57.12 30.84,58.06 U1.18
IO11/DB5
  Top 0.305: P5.22 32.28,58.57 U1.19
IO12/DB4
  Top 0.305: P5.21 32.78,57.44 33.38,58.04 U1.20
IO13/DB3
  Top 0.305: P5.20 33.28,56.7 34.65,58.06 U1.21
IO14/DB2
  Top 0.305: P5.19 33.78,55.95 35.92,58.09 U1.22
IO15/DB11  (via drill 0.3)
  Top 0.254: P5.28 29.28,45.27 v29.75,44.81 | U1.8 v28.45,67.62 v28.45,67.61
  Bottom 0.254: v29.75,44.81 29.44,45.11 29.44,49.91 28.32,51.03 28.32,67.49 v28.45,67.61
IO16/DB10  (via drill 0.3)
  Top 0.254: P5.27 29.78,45.63 v30.51,44.91 | U1.9 v28.93,66.34
  Bottom 0.254: v30.51,44.91 29.95,45.47 29.95,50.16 28.81,51.31 28.81,66.22 v28.93,66.34
IO17/LCD_RS  (via drill 0.3)
  Top 0.305: U1.10 v38.28,65.08 | v38.28,45.39 P5.10
  Bottom 0.305: v38.28,65.08 v38.28,45.39
IO18/LCD_WR  (via drill 0.3)
  Top 0.305: R27.1 U1.11 v37.54,63.81 v37.54,63.8 | P5.11 37.78,46.06 v37.32,45.59
  Bottom 0.305: v37.32,45.59 37.54,45.82 v37.54,63.8
IO19
  Top 0.305: U1.13 18.06,61.27 17.33,62 17,62 | 17,62 J1.1 | R20.2 17.68,60.83 | 17.68,60.83 17.68,61.32 17,62 | 17.68,60.83 18.09,61.24 | 18.11,61.27 18.09,61.24 | 18.09,61.24 17.73,61.24
IO20  (via drill 0.3)
  Top 0.305: R21.2 18.6,50.14 18.6,59.18 v19.41,59.99 20.04,59.99 U1.14 | J1.2 v19.4,64 v19.41,64.01
  Bottom 0.305: v19.41,64.01 v19.41,59.99
IO21/DB1
  Top 0.305: P5.18 34.28,55.16 37.19,58.06 U1.23
IO38/TWI_SDA  (via drill 0.3)
  Top 0.254: U1.31 v41.61,65.08 | v39.98,23.7 39.74,23.94 P2.2 39.74,28.31 39.37,28.68 21.18,28.68 v19.05,30.81 | J2.2 v19.05,36.4 | v54.37,48.17 U8.9 51.32,48.17 50.8,47.65 v50.8,23.7 | R44.1 54.8,48.17 v54.37,48.17 | v54.37,48.17 v54.36,48.16
  Bottom 0.254: v39.98,23.7 v50.8,23.7 | v19.05,30.81 v19.05,36.4 | v41.61,65.08 49.18,57.51 49.18,54.99 53.09,51.08 53.09,49.17 54.11,48.16 v54.36,48.16
IO39/TWI_SCK  (via drill 0.3)
  Top 0.254: U1.32 v41.61,66.35 v41.61,66.34 | v40.54,24.31 40.24,24.61 P2.3 40.24,28.6 39.7,29.13 21.85,29.13 16.58,34.4 J2.1 | R43.1 55.15,48.92 v54.36,48.92 53.78,48.92 53.52,48.67 U8.10 50.93,48.67 50.22,47.95 50.22,24.38 v50.15,24.31
  Bottom 0.254: v50.15,24.31 v40.54,24.31 | v41.61,66.34 49.79,58.17 49.79,55.22 53.65,51.36 53.65,49.63 v54.36,48.92
IO40  (via drill 0.3)
  Top 0.254: U1.33 v41.59,67.62 v41.58,67.61 | P2.4 40.74,25.05 v40.85,24.94 | R42.1 54.39,45.98 v54.38,45.97 53.19,47.17 U8.7 51.77,47.17 51.39,46.79 v51.39,24.79
  Bottom 0.254: v41.58,67.61 50.37,58.83 50.37,55.5 54.28,51.59 54.28,49.96 55.12,49.12 55.12,46.71 v54.38,45.97 | v40.85,24.94 51.24,24.94 v51.39,24.79
IO41/MISO  (via drill 0.3)
  Top 0.305: D4.6 52.75,58.1 v53.41,57.44 53.57,57.28 R6.1 | SD.7 45.13,65.2 47.3,65.2 v47.48,65.38 | v43.74,69.01 42.89,69.01 U1.34
  Bottom 0.305: v53.41,57.44 53.34,57.51 53.34,59.41 47.48,65.28 | v43.74,69.01 47.48,65.28 | v47.48,65.38 47.48,65.28
IO42/SCLK  (via drill 0.3)
  Top 0.305: D4.5 v51.98,57.56 51.98,56.56 R5.1 | SD.5 v44.17,67.36 | U1.35 v41.56,70.16 U1.35
  Bottom 0.305: 44.17,67.54 51.98,59.73 v51.98,57.56 | v44.17,67.36 44.17,67.54 | 44.17,67.54 v41.56,70.16
IO45  (via drill 0.3)
  Top 0.254: R41.2 v30.38,55.9 v30.38,55.91 | U1.26 41,59.66 40.69,59.97 v30.38,59.97
  Bottom 0.254: v30.38,55.91 v30.38,59.97
IO46/LCD_CS  (via drill 0.3)
  Top 0.305: P5.9 38.78,49.17 39.17,49.55 v39.17,49.91 39.17,50.72 R34.2 | U1.16 28.3,60.22 28.76,60.68 v39.14,60.68
  Bottom 0.305: v39.14,60.68 39.14,49.94 v39.17,49.91
IO47/DB0
  Top 0.305: P5.17 34.78,54.21 38.46,57.89 U1.24
IO48/LCD_RD
  Top 0.305: U1.25 39.73,57.76 38.18,56.21 38.18,49.68 37.28,48.78 P5.12
N$1
  Top 0.254: IC1.16 26.59,25.25 C4.2
N$2
  Top 0.254: Q4.1 18.36,10.11 R26.1
N$3
  Top 0.305: R25.1 12.37,10.04 Q3.1
N$4
  Top 0.305: P5.14 36.28,49.42 D6.+ R2.2
N$5
  Top 0.305: Q2.1 31.33,20.08 R45.2 29.62,20.12 R50.1
N$6
  Top 0.305: USB.A5 14.72,50.96 R15.2
N$7
  Top 0.406: PWR.C R19.2
N$8
  Top 0.406: R18.1 28.66,16.03 LED1.1
N$9
  Top 0.406: Q2.3 33.43,16.84 LED1.2
N$10
  Top 0.305: USB-TTL.A5 16.42,26.25 R13.2
N$11
  Top 0.305: USB-TTL.B5 15.38,23.25 R12.2
N$12
  Top 0.254: R10.1 20.73,21.29 | 20.73,21.29 21.19,21.29 R11.1 | 20.73,21.29 20.73,21.91 21.82,23 IC1.7
  pour Top: 21.92,23.29 20.86,23.29 19.36,21.79 19.36,20.52 21.85,20.52 21.92,20.52
N$14
  Top 0.305: USB.B5 15.72,47.96 R14.2
N$18
  Top 0.254: IC1.21 23.38,27.88 23.73,28.22 27.46,28.22 R29.2
N$19
  Top 0.254: IC1.20 23.88,27.59 24.06,27.76 26.23,27.76 R30.2
N$20
  Top 0.305: P5.34 26.28,50.82 R37.1
N$21
  Top 0.305: P5.35 25.78,50.5 R38.1
N$22
  Top 0.305: P5.36 25.28,49.46 R39.1
N$23  (1 unrouted)
  Top 0.254: 27.74,54.36 28.15,53.95 28.15,53.75
  Top 0.305: Q1.1 26.92,54.27 R24.2 28.17,54.38 | 28.17,54.38 R41.1 | R40.1 28.16,54.37 28.17,54.38
N$24
  Top 0.305: R37.2 R38.2 R39.2 23.58,55.08 Q1.3
N$25  (via drill 0.3)
  Top 0.254: U8.8 53.73,47.67 v54.08,47.32 | R49.2 R52.1 v52.4,50.81 v52.4,50.8
  Bottom 0.254: v52.4,50.8 52.4,49 v54.08,47.32
N$47
  Top 0.305: SD.1 50.49,71.76 53.62,68.63 53.62,61.09 R7.1
N$48
  Top 0.305: SD.8 46.08,64.06 47.58,62.56 R9.1
RESET  (via drill 0.3)
  Top 0.254: P5.15 35.78,44.99 v35.79,44.98 | P2.5 41.24,26.02 v41.61,25.65
  Top 0.305: RST.2 9.75,8.29 | Q4.3 | C1.2 35.78,50.68 P5.15
  Top 0.61: 9.75,8.29 11.52,6.52 Q4.3 46.73,6.52 58.52,18.31 58.52,24.43 58.52,24.84 | v35.79,73.97 U1.3 22.79,73.97 R16.1 C8.1 | 58.52,24.84 58.52,25.63 | 58.52,26.47 58.52,40.01 | 58.52,40.01 58.52,40.79 | 58.52,41.53 58.52,52.17 57.94,52.76 R47.1 | v53.05,40.77 57.76,40.77 | 57.76,40.77 58.5,40.77 58.52,40.79 | v53.05,25.65 57.71,25.65 | 57.71,25.65 58.5,25.65 58.52,25.63 | 57.76,40.77 58.52,41.53 | 58.52,41.53 58.52,40.79 | 58.52,40.01 57.76,40.77 | 57.71,25.65 58.52,26.47 | 58.52,26.47 58.52,25.63 | 58.52,24.84 57.71,25.65
  Top 0.813: R17.1 R47.1
  Bottom 0.61: v35.79,73.97 v35.79,44.98 35.79,44.32 39.35,40.77 v53.05,40.77 | v41.61,25.65 v53.05,25.65
RTS  (via drill 0.3)
  Top 0.254: IC1.19 26.17,27 v26.34,26.82 | v15.45,8.43 16.33,8.43 Q4.2
  Top 0.305: R25.2 v15.45,8.43
  Bottom 0.254: v26.34,26.82 26.34,16.18 22.58,12.42 15.65,12.42 15.45,12.22 v15.45,8.43
RXD/IO44  (via drill 0.3)
  Top 0.254: v39.83,71.42 U1.36 | R29.1 31.13,27.22 v31.17,27.25
  Bottom 0.254: v39.83,71.42 40.16,71.09 40.16,55.35 53.78,41.73 53.78,32.28 49.23,27.74 31.65,27.74 v31.17,27.25
TXD/IO43  (via drill 0.3)
  Top 0.254: R30.1 32.19,25.36 v32.19,26.98 | v40.64,72.69 v40.65,72.7 U1.37
  Top 0.305: R50.2 31.17,21.77 R30.1
  Bottom 0.254: v40.64,72.69 40.64,55.68 54.28,42.04 54.28,31.93 49.58,27.23 32.44,27.23 v32.19,26.98
USB_D+
  Top 0.305: R21.1 15.89,48.96 USB.B6 12.67,48.96 12.47,49.15 12.47,49.78 12.65,49.96 | 12.65,49.96 | USB.A6 12.65,49.96
USB_D-
  Top 0.254: 14.2,50.47 14.58,50.09 14.58,50.06 14.99,50.47 15.17,50.47
  Top 0.305: USB.B7 14.63,50.46 | 14.63,50.46 15.84,50.46 R20.1 | USB.A7 14.28,49.46 14.58,49.76 14.58,50.06 14.58,50.41 14.63,50.46
VBUS  (via drill 0.3)
  Top 0.254: IC1.8 22.38,22.2 22.99,21.59 R11.2 | C6.2 R11.2 | D5.A 22.99,19.02 R11.2
  Top 0.61: USB-TTL.VBUS2 v15.39,22.55 v15.4,22.55 | USB-TTL.VBUS1 15.93,27.45 | 15.93,27.45 16.07,27.45 C7.2 | v15.4,27.46 15.92,27.46 15.93,27.45 | v20.98,18.77 21,18.79 D5.A
  Bottom 0.61: v15.4,27.46 v15.4,22.55 19.18,18.77 v20.98,18.77
  pour Top: 24.95,21.46 23.42,21.46 22.56,22.33 22.56,23.29 22.3,23.29 22.3,21.89 22.38,21.82 22.38,20.19 21.95,19.76 20.75,19.76 20.75,17.86 24.79,17.86 24.95,17.86
XL
  Top 0.254: U8.4 42.95,47.17 P5.1
XR  (1 unrouted)
  Top 0.254: 41.79,47.04 41.79,48.34 42.45,49 46.49,49 47.31,48.17 U8.2
YD  (via drill 0.3)
  Top 0.254: U8.3 44.89,47.67 v44.76,47.8 | P5.4 41.28,48.72 42.19,49.63 v44.76,49.63
  Bottom 0.254: v44.76,49.63 v44.76,47.8
YU  (via drill 0.3)
  Top 0.254: P5.2 42.28,47.89 42.83,48.44 46.1,48.44 v46.26,48.28 | v48.47,46.08 48.47,46.5 U8.5
  Bottom 0.254: v46.26,48.28 v48.47,46.08

### Text on the board
tPlace: GND | +3V3 | IO20 | IO19 | GND | +3V3 | IO38 | SDA | IO39 | SCL | www.makerfabs.com | ESP32-S3 Parallel TFT | with Touch 3.5" ili9488 v2.0